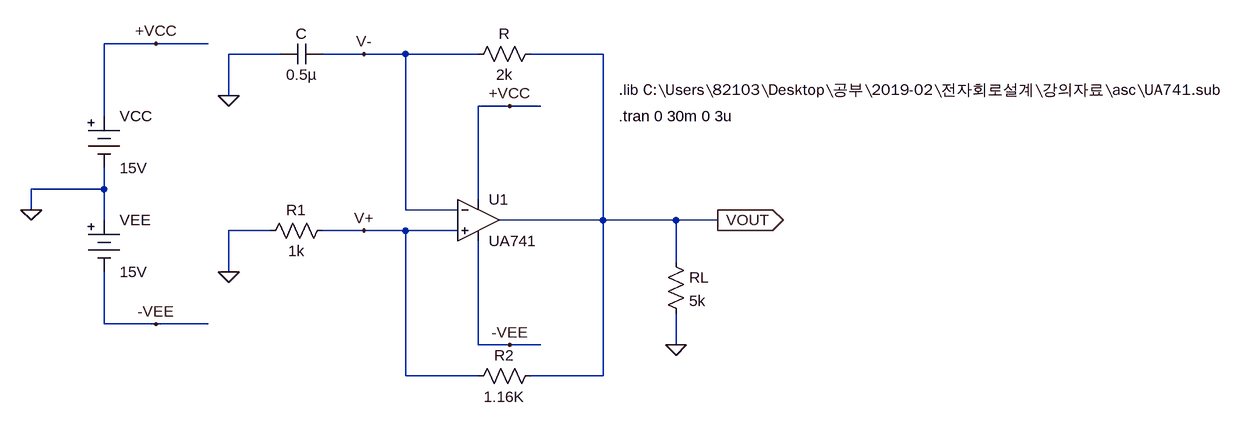
[diagram p0: schematic lab1.asc]
lab1.asc, the LTspice schematic file:
Version 4
SHEET 1 1548 724
WIRE -160 -96 -240 -96
WIRE -80 -96 -160 -96
WIRE 32 -80 -48 -80
WIRE 160 -80 96 -80
WIRE 224 -80 160 -80
WIRE 336 -80 224 -80
WIRE 528 -80 416 -80
WIRE -48 -16 -48 -80
WIRE 384 0 336 0
WIRE 432 0 384 0
WIRE -240 16 -240 -96
WIRE -240 128 -240 96
WIRE -240 128 -352 128
WIRE 336 144 336 0
WIRE -352 160 -352 128
WIRE 224 160 224 -80
WIRE 304 160 224 160
WIRE -240 176 -240 128
WIRE 528 176 528 -80
WIRE 528 176 368 176
WIRE 640 176 528 176
WIRE 704 176 640 176
WIRE 16 192 -48 192
WIRE 160 192 96 192
WIRE 224 192 160 192
WIRE 304 192 224 192
WIRE 640 240 640 176
WIRE -48 256 -48 192
WIRE -240 336 -240 256
WIRE -160 336 -240 336
WIRE -80 336 -160 336
WIRE 336 368 336 208
WIRE 384 368 336 368
WIRE 432 368 384 368
WIRE 640 368 640 320
WIRE 224 416 224 192
WIRE 336 416 224 416
WIRE 528 416 528 176
WIRE 528 416 416 416
FLAG 704 176 VOUT
IOPIN 704 176 Out
FLAG -352 160 0
FLAG -160 -96 +VCC
FLAG 384 0 +VCC
FLAG -160 336 -VEE
FLAG 384 368 -VEE
FLAG 640 368 0
FLAG -48 -16 0
FLAG -48 256 0
FLAG 160 -80 V-
FLAG 160 192 V+
SYMBOL Opamps\\opamp2 336 112 R0
SYMATTR InstName U1
SYMATTR Value UA741
SYMBOL res 624 224 R0
SYMATTR InstName RL
SYMATTR Value 5k
SYMBOL Misc\\battery -240 0 R0
SYMATTR InstName VCC
SYMATTR Value 15V
SYMBOL Misc\\battery -240 160 R0
SYMATTR InstName VEE
SYMATTR Value 15V
SYMBOL res 432 -96 R90
WINDOW 0 0 56 VBottom 2
WINDOW 3 32 56 VTop 2
SYMATTR InstName R
SYMATTR Value 2k
SYMBOL cap 96 -96 R90
WINDOW 0 0 32 VBottom 2
WINDOW 3 32 32 VTop 2
SYMATTR InstName C
SYMATTR Value 0.5µ
SYMBOL res 112 176 R90
WINDOW 0 0 56 VBottom 2
WINDOW 3 32 56 VTop 2
SYMATTR InstName R1
SYMATTR Value 1k
SYMBOL res 432 400 R90
WINDOW 0 0 56 VBottom 2
WINDOW 3 32 56 VTop 2
SYMATTR InstName R2
SYMATTR Value 1.16K
TEXT 552 -24 Left 2 !.lib C:\\Users\\82103\\Desktop\\공부\\2019-02\\전자회로설계\\강의자료\\asc\\UA741.sub
TEXT 552 16 Left 2 !.tran 0 30m 0 3u

The netlist it stands for:
* lab1.asc
XU1 V+ V- +VCC -VEE VOUT UA741  ; pins In+ In- V+ V- OUT
RL VOUT 0 5k
VCC +VCC 0 15V
VEE 0 -VEE 15V
R VOUT V- 2k
C V- 0 0.5µ
R1 V+ 0 1k
R2 VOUT V+ 1.16K
.lib C:\Users\82103\Desktop\공부\2019-02\전자회로설계\강의자료\asc\UA741.sub
.tran 0 30m 0 3u
.backanno
.end